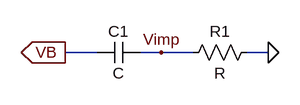
[diagram p0: schematic vimp.asc]
vimp.asc, the LTspice schematic file:
Version 4
SHEET 1 880 680
WIRE 80 64 32 64
WIRE 176 64 144 64
WIRE 224 64 176 64
WIRE 336 64 304 64
FLAG 336 64 0
FLAG 32 64 VB
IOPIN 32 64 Out
FLAG 176 64 Vimp
SYMBOL res 208 80 R270
WINDOW 0 32 56 VTop 2
WINDOW 3 0 56 VBottom 2
SYMATTR InstName R1
SYMBOL cap 80 80 R270
WINDOW 0 32 32 VTop 2
WINDOW 3 0 32 VBottom 2
SYMATTR InstName C1

The netlist it stands for:
* vimp.asc
R1 Vimp 0 R
C1 VB Vimp C
.backanno
.end